# EAGLE design GB Cart Extender (EAGLE 9.0.1)
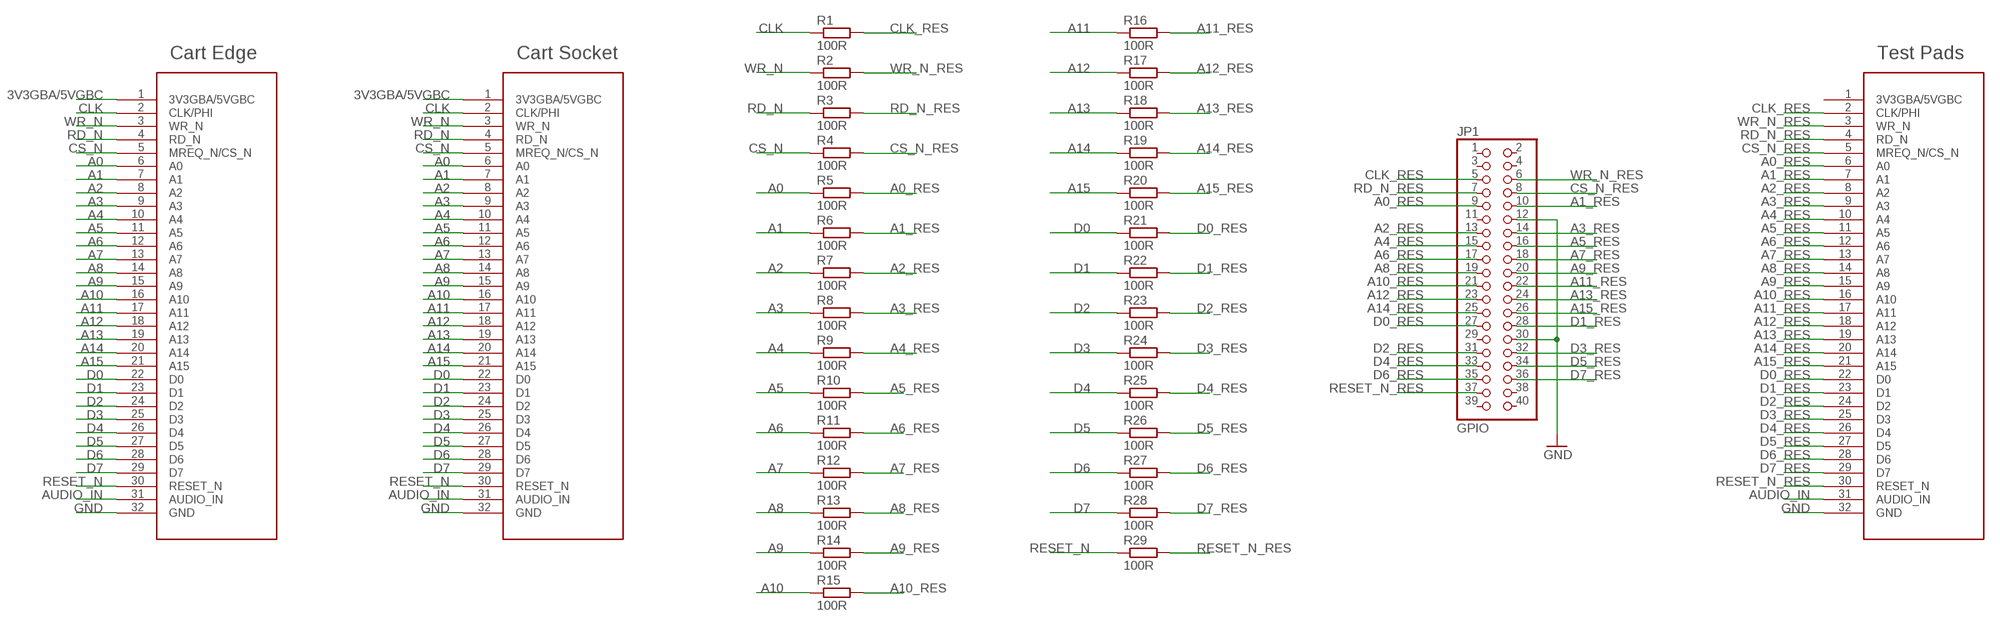
[diagram p0: schematic, sheet 1]

## Parts
EDGE  GB_CART_EDGE  [GB_CART_EDGE]
JP1  GPIO  PINHD-2X20SMT  [2X20_SMT]
PADS  GB_CART_SOCKET  [GB_CART_1]
R1  100R  R-EU_R0603  [R0603]
R2  100R  R-EU_R0603  [R0603]
R3  100R  R-EU_R0603  [R0603]
R4  100R  R-EU_R0603  [R0603]
R5  100R  R-EU_R0603  [R0603]
R6  100R  R-EU_R0603  [R0603]
R7  100R  R-EU_R0603  [R0603]
R8  100R  R-EU_R0603  [R0603]
R9  100R  R-EU_R0603  [R0603]
R10  100R  R-EU_R0603  [R0603]
R11  100R  R-EU_R0603  [R0603]
R12  100R  R-EU_R0603  [R0603]
R13  100R  R-EU_R0603  [R0603]
R14  100R  R-EU_R0603  [R0603]
R15  100R  R-EU_R0603  [R0603]
R16  100R  R-EU_R0603  [R0603]
R17  100R  R-EU_R0603  [R0603]
R18  100R  R-EU_R0603  [R0603]
R19  100R  R-EU_R0603  [R0603]
R20  100R  R-EU_R0603  [R0603]
R21  100R  R-EU_R0603  [R0603]
R22  100R  R-EU_R0603  [R0603]
R23  100R  R-EU_R0603  [R0603]
R24  100R  R-EU_R0603  [R0603]
R25  100R  R-EU_R0603  [R0603]
R26  100R  R-EU_R0603  [R0603]
R27  100R  R-EU_R0603  [R0603]
R28  100R  R-EU_R0603  [R0603]
R29  100R  R-EU_R0603  [R0603]
SOCKET  GB_CART_SOCKET  [GB_CART_1]

## Nets
3V3GBA/5VGBC: EDGE.1(3V3GBA/5VGBC) SOCKET.1(3V3GBA/5VGBC)
A0: EDGE.6(A0) R5.1 SOCKET.6(A0)
A0_RES: JP1.9 PADS.6(A0) R5.2
A1: EDGE.7(A1) R6.1 SOCKET.7(A1)
A1_RES: JP1.10 PADS.7(A1) R6.2
A2: EDGE.8(A2) R7.1 SOCKET.8(A2)
A2_RES: JP1.13 PADS.8(A2) R7.2
A3: EDGE.9(A3) R8.1 SOCKET.9(A3)
A3_RES: JP1.14 PADS.9(A3) R8.2
A4: EDGE.10(A4) R9.1 SOCKET.10(A4)
A4_RES: JP1.15 PADS.10(A4) R9.2
A5: EDGE.11(A5) R10.1 SOCKET.11(A5)
A5_RES: JP1.16 PADS.11(A5) R10.2
A6: EDGE.12(A6) R11.1 SOCKET.12(A6)
A6_RES: JP1.17 PADS.12(A6) R11.2
A7: EDGE.13(A7) R12.1 SOCKET.13(A7)
A7_RES: JP1.18 PADS.13(A7) R12.2
A8: EDGE.14(A8) R13.1 SOCKET.14(A8)
A8_RES: JP1.19 PADS.14(A8) R13.2
A9: EDGE.15(A9) R14.1 SOCKET.15(A9)
A9_RES: JP1.20 PADS.15(A9) R14.2
A10: EDGE.16(A10) R15.1 SOCKET.16(A10)
A10_RES: JP1.21 PADS.16(A10) R15.2
A11: EDGE.17(A11) R16.1 SOCKET.17(A11)
A11_RES: JP1.22 PADS.17(A11) R16.2
A12: EDGE.18(A12) R17.1 SOCKET.18(A12)
A12_RES: JP1.23 PADS.18(A12) R17.2
A13: EDGE.19(A13) R18.1 SOCKET.19(A13)
A13_RES: JP1.24 PADS.19(A13) R18.2
A14: EDGE.20(A14) R19.1 SOCKET.20(A14)
A14_RES: JP1.25 PADS.20(A14) R19.2
A15: EDGE.21(A15) R20.1 SOCKET.21(A15)
A15_RES: JP1.26 PADS.21(A15) R20.2
AUDIO_IN: EDGE.31(AUDIO_IN) PADS.31(AUDIO_IN) SOCKET.31(AUDIO_IN)
CLK: EDGE.2(CLK/PHI) R1.1 SOCKET.2(CLK/PHI)
CLK_RES: JP1.5 PADS.2(CLK/PHI) R1.2
CS_N: EDGE.5(MREQ_N/CS_N) R4.1 SOCKET.5(MREQ_N/CS_N)
CS_N_RES: JP1.8 PADS.5(MREQ_N/CS_N) R4.2
D0: EDGE.22(D0) R21.1 SOCKET.22(D0)
D0_RES: JP1.27 PADS.22(D0) R21.2
D1: EDGE.23(D1) R22.1 SOCKET.23(D1)
D1_RES: JP1.28 PADS.23(D1) R22.2
D2: EDGE.24(D2) R23.1 SOCKET.24(D2)
D2_RES: JP1.31 PADS.24(D2) R23.2
D3: EDGE.25(D3) R24.1 SOCKET.25(D3)
D3_RES: JP1.32 PADS.25(D3) R24.2
D4: EDGE.26(D4) R25.1 SOCKET.26(D4)
D4_RES: JP1.33 PADS.26(D4) R25.2
D5: EDGE.27(D5) R26.1 SOCKET.27(D5)
D5_RES: JP1.34 PADS.27(D5) R26.2
D6: EDGE.28(D6) R27.1 SOCKET.28(D6)
D6_RES: JP1.35 PADS.28(D6) R27.2
D7: EDGE.29(D7) R28.1 SOCKET.29(D7)
D7_RES: JP1.36 PADS.29(D7) R28.2
GND: EDGE.32(GND) JP1.12 JP1.30 PADS.32(GND) SOCKET.32(GND)
RD_N: EDGE.4(RD_N) R3.1 SOCKET.4(RD_N)
RD_N_RES: JP1.7 PADS.4(RD_N) R3.2
RESET_N: EDGE.30(RESET_N) R29.1 SOCKET.30(RESET_N)
RESET_N_RES: JP1.37 PADS.30(RESET_N) R29.2
WR_N: EDGE.3(WR_N) R2.1 SOCKET.3(WR_N)
WR_N_RES: JP1.6 PADS.3(WR_N) R2.2
Unconnected: JP1.1 JP1.2 JP1.3 JP1.4 JP1.11 JP1.29 JP1.38 JP1.39 JP1.40 PADS.1(3V3GBA/5VGBC)

## Notes on the sheet
- Cart Edge | Cart Socket | Test Pads

## Library data of the parts
EDGE = alex:GB_CART_EDGE
JP1 = pinhead+:PINHD-2X20: PIN HEADER; SPICEPREFIX: X
PADS = alex:GB_CART_SOCKET; SPICEPREFIX: X
R1-R29 = rcl:R-EU_: RESISTOR, European symbol; SPICEPREFIX: R
SOCKET = alex:GB_CART_SOCKET

## Board
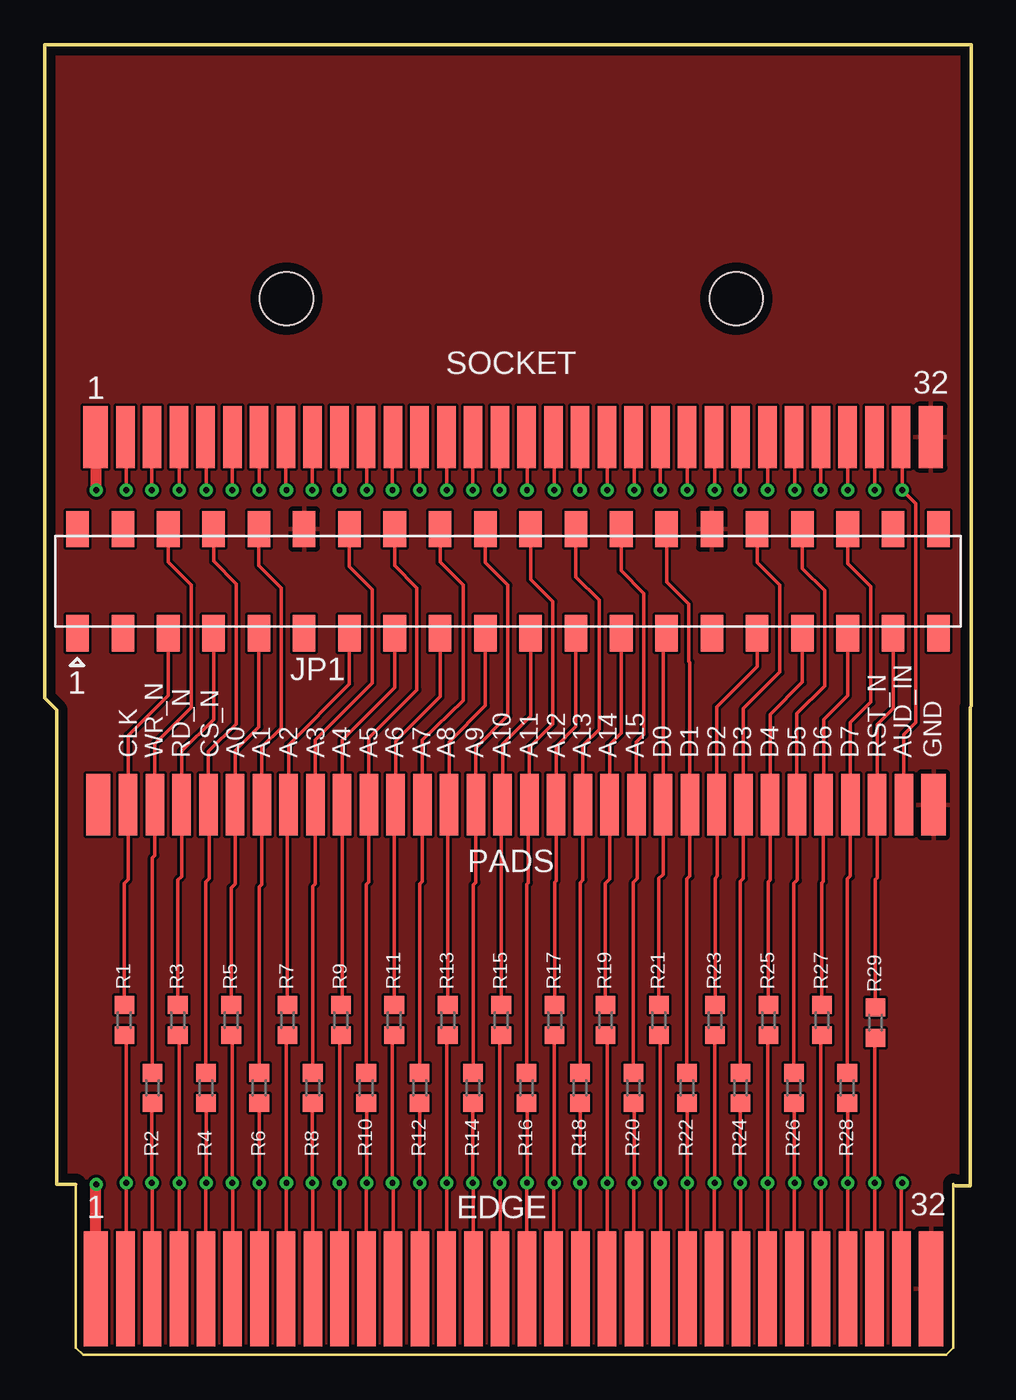
[diagram p1: board, top side]
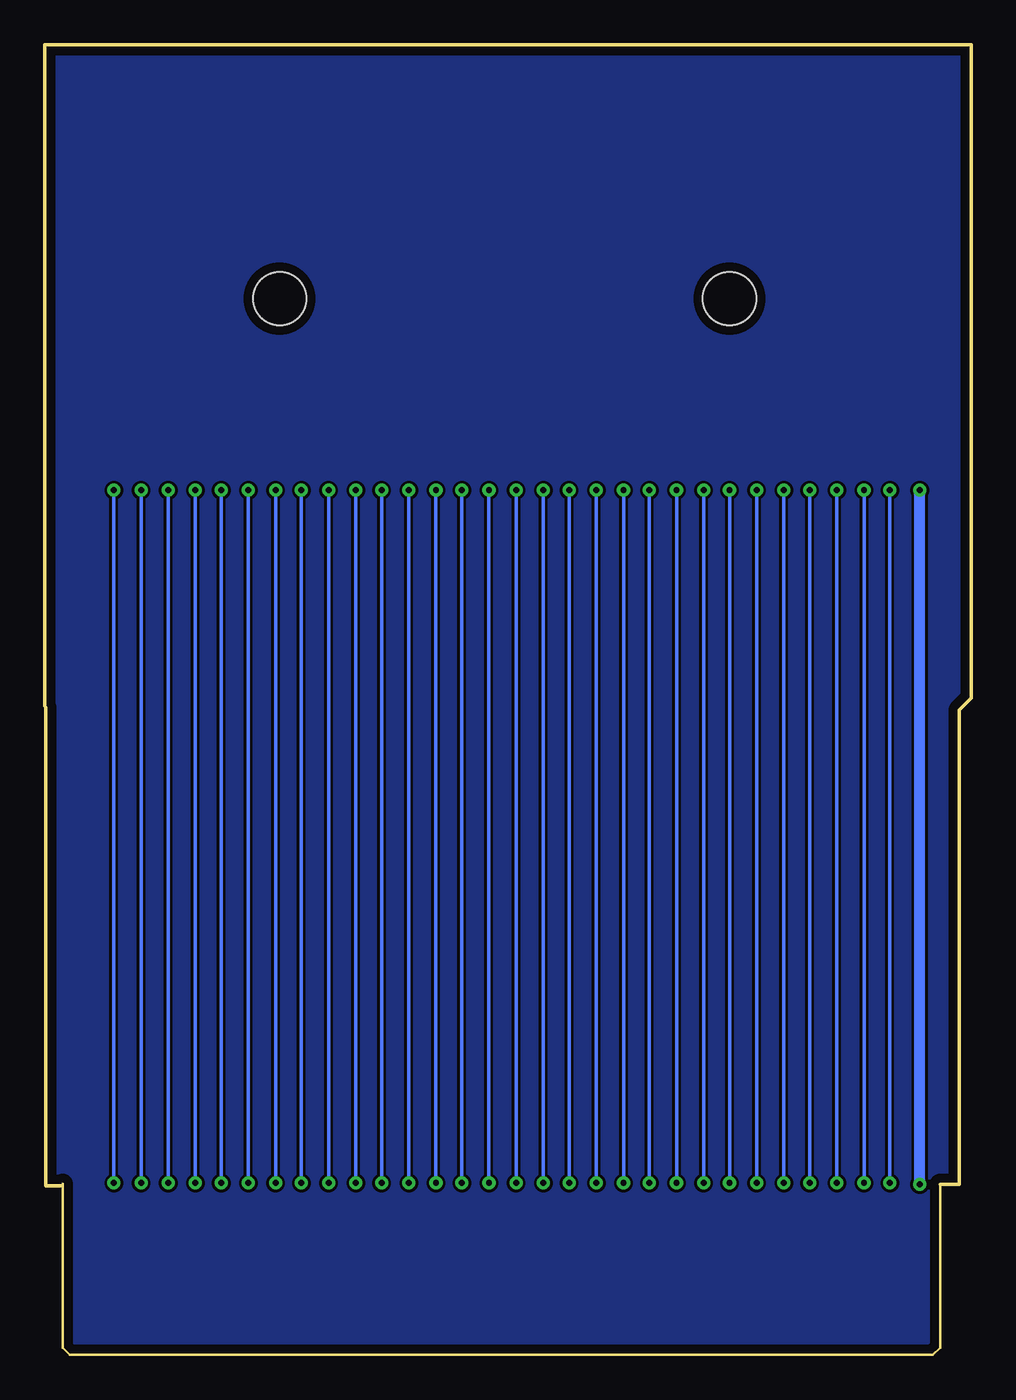
[diagram p2: board, bottom side, seen from below]

Size 51.97 x 73.5 mm. Coordinates in mm from the lower left corner, seen from the top.
Outline: 50.98,9.49 51.89,9.49 51.89,36.31 51.97,36.39 51.97,73.5 0,73.5 0,36.85 0.69,36.16 0.69,9.57 1.75,9.57
Copper layers (1*16): Top 0.035mm / dielectric 1.5mm / Bottom 0.035mm
Design rules "default *": minimum track width 5mil, minimum drill 13mil, track to track 6mil, track to pad 6mil, pad to pad 6mil, via to via 6mil, smd to smd 6mil, copper to edge 20mil, drill to drill 8mil, minimum pad ring 10mil, minimum via ring 8mil, stop-mask expansion 4mil, vias tented up to drill 0mil, thermal gap 10mil
Holes 3 mm at 13.56,59.25 38.79,59.25

### Footprints (pad centres in the part's own frame; a part is rotated, then mirrored left to right if it is on the bottom)
GB_CART_EDGE = smd 1.36 x 6.46: 1 -22.885,0.11; 32 23.95,0.11 | smd 1.03 x 6.46: 2 -21.215,0.11; 3 -19.715,0.11; 4 -18.215,0.11; 5 -16.715,0.11; 6 -15.215,0.11; 7 -13.715,0.11; 8 -12.215,0.11; 9 -10.715,0.11; 10 -9.215,0.11; 11 -7.715,0.11; 12 -6.215,0.11; 13 -4.715,0.11; 14 -3.215,0.11; 15 -1.715,0.11; 16 -0.215,0.11; 17 1.285,0.11; 18 2.785,0.11; 19 4.285,0.11; 20 5.785,0.11; 21 7.285,0.11; 22 8.785,0.11; 23 10.285,0.11; 24 11.785,0.11; 25 13.285,0.11; 26 14.785,0.11; 27 16.285,0.11; 28 17.785,0.11; 29 19.285,0.11; 30 20.785,0.11; 31 22.285,0.11
2X20_SMT = smd 1.27 x 2.032: 1 -24.13,-2.921; 2 -24.13,2.921; 3 -21.59,-2.921; 4 -21.59,2.921; 5 -19.05,-2.921; 6 -19.05,2.921; 7 -16.51,-2.921; 8 -16.51,2.921; 9 -13.97,-2.921; 10 -13.97,2.921; 11 -11.43,-2.921; 12 -11.43,2.921; 13 -8.89,-2.921; 14 -8.89,2.921; 15 -6.35,-2.921; 16 -6.35,2.921; 17 -3.81,-2.921; 18 -3.81,2.921; 19 -1.27,-2.921; 20 -1.27,2.921; 21 1.27,-2.921; 22 1.27,2.921; 23 3.81,-2.921; 24 3.81,2.921; 25 6.35,-2.921; 26 6.35,2.921; 27 8.89,-2.921; 28 8.89,2.921; 29 11.43,-2.921; 30 11.43,2.921; 31 13.97,-2.921; 32 13.97,2.921; 33 16.51,-2.921; 34 16.51,2.921; 35 19.05,-2.921; 36 19.05,2.921; 37 21.59,-2.921; 38 21.59,2.921; 39 24.13,-2.921; 40 24.13,2.921
GB_CART_1 = smd 1.36 x 3.46: 1 -22.895,-0.12; 32 23.94,-0.12 | smd 1.03 x 3.46: 2 -21.225,-0.12; 3 -19.725,-0.12; 4 -18.225,-0.12; 5 -16.725,-0.12; 6 -15.225,-0.12; 7 -13.725,-0.12; 8 -12.225,-0.12; 9 -10.725,-0.12; 10 -9.225,-0.12; 11 -7.725,-0.12; 12 -6.225,-0.12; 13 -4.725,-0.12; 14 -3.225,-0.12; 15 -1.725,-0.12; 16 -0.225,-0.12; 17 1.275,-0.12; 18 2.775,-0.12; 19 4.275,-0.12; 20 5.775,-0.12; 21 7.275,-0.12; 22 8.775,-0.12; 23 10.275,-0.12; 24 11.775,-0.12; 25 13.275,-0.12; 26 14.775,-0.12; 27 16.275,-0.12; 28 17.775,-0.12; 29 19.275,-0.12; 30 20.775,-0.12; 31 22.275,-0.12
R0603 = smd 1 x 1.1: 1 -0.85,0; 2 0.85,0

### Placement (x,y rotation side)
EDGE  25.76,3.6 0 top
JP1  25.98,43.4 0 top
PADS  25.91,30.98 0 top
R1  4.47,18.79 90 top
R2  6.05,14.98 90 top
R3  7.47,18.79 90 top
R4  9.04,14.98 90 top
R5  10.46,18.79 90 top
R6  12.04,14.98 90 top
R7  13.61,18.79 90 top
R8  15.04,14.98 90 top
R9  16.61,18.79 90 top
R10  18.03,14.98 90 top
R11  19.61,18.79 90 top
R12  21.03,14.98 90 top
R13  22.61,18.79 90 top
R14  24.03,14.98 90 top
R15  25.6,18.79 90 top
R16  27.03,14.98 90 top
R17  28.6,18.79 90 top
R18  30.02,14.98 90 top
R19  31.45,18.79 90 top
R20  33.02,14.98 90 top
R21  34.44,18.79 90 top
R22  36.02,14.98 90 top
R23  37.59,18.79 90 top
R24  39.01,14.98 90 top
R25  40.59,18.79 90 top
R26  42.01,14.98 90 top
R27  43.59,18.79 90 top
R28  45.01,14.98 90 top
R29  46.58,18.64 90 top
SOCKET  25.76,51.61 0 top

### Tracks (layer width: path | path; a pad name or v marks a point on that pad's centre or on a via)
3V3GBA/5VGBC  (via drill 0.33)
  Top 0.203: 2.87,9.54 v2.9,9.57 | 2.9,51.45 SOCKET.1
  Top 0.61: EDGE.1 2.87,9.54 | v2.9,48.51 2.9,51.45
  Bottom 0.61: v2.9,9.57 v2.9,48.51
A0  (via drill 0.33)
  Top 0.203: 10.54,17.86 10.52,17.89 | EDGE.6 10.54,9.62 v10.52,9.64 10.52,17.89 | v10.52,48.51 10.52,51.47 SOCKET.6 | 10.52,17.89 R5.1
  Bottom 0.203: v10.52,9.64 v10.52,48.51
A0_RES
  Top 0.203: R5.2 10.46,26.21 10.68,26.42 PADS.6 10.68,33.89 12.01,35.22 JP1.9
A1  (via drill 0.33)
  Top 0.203: EDGE.7 v12.04,9.64 | v12.04,9.64 | v12.04,48.51 v12.03,48.52 SOCKET.7 | v12.04,9.64 R6.1
  Bottom 0.203: v12.04,9.64 v12.04,48.51
A1_RES
  Top 0.203: JP1.10 12.01,44.27 13.26,43.02 13.26,35.17 12.18,34.1 PADS.7 12.18,26.4 12.04,26.26 R6.2
A2  (via drill 0.33)
  Top 0.203: EDGE.8 13.54,9.62 v13.56,9.64 13.56,17.89 R7.1 | v13.56,48.51 13.53,48.54 SOCKET.8
  Bottom 0.203: v13.56,9.64 v13.56,48.51
A2_RES
  Top 0.203: R7.2 13.61,30.79 PADS.8 13.68,34.22 17.09,37.64 JP1.13
A3  (via drill 0.33)
  Top 0.203: R8.1 15.01,14.1 v15.01,9.64 15.04,9.62 EDGE.9 | v15.01,48.51 15.01,51.47 SOCKET.9
  Bottom 0.203: v15.01,9.64 v15.01,48.51
A3_RES
  Top 0.203: JP1.14 17.09,44.22 18.36,42.95 18.36,37.69 15.18,34.51 PADS.9 15.18,26.43 15.04,26.28 R8.2
A4  (via drill 0.33)
  Top 0.203: EDGE.10 v16.54,9.64 | v16.54,9.64 | v16.54,48.51 SOCKET.10 | v16.54,9.64 16.54,17.87 R9.1
  Bottom 0.203: v16.54,9.64 v16.54,48.51
A4_RES
  Top 0.203: R9.2 16.68,19.71 PADS.10 16.68,34.48 19.63,37.43 JP1.15
A5  (via drill 0.33)
  Top 0.203: EDGE.11 18.04,9.63 v18.06,9.64 18.06,14.1 R10.1 | v18.06,48.51 18.06,51.46 SOCKET.11
  Bottom 0.203: v18.06,9.64 v18.06,48.51
A5_RES
  Top 0.203: JP1.16 19.63,44.27 20.88,43.02 20.88,37.31 18.18,34.61 PADS.11 18.18,26.53 18.03,26.38 R10.2
A6  (via drill 0.33)
  Top 0.203: EDGE.12 19.54,9.61 v19.51,9.64 19.51,17.84 R11.1 | v19.51,48.51 19.51,51.46 SOCKET.12
  Bottom 0.203: v19.51,9.64 v19.51,48.51
A6_RES
  Top 0.203: R11.2 19.61,30.79 PADS.12 19.68,34.43 22.17,36.92 JP1.17
A7  (via drill 0.33)
  Top 0.203: R12.1 21.03,14.11 v21.03,9.64 21.04,9.64 EDGE.13 | v21.03,48.51 SOCKET.13
  Bottom 0.203: v21.03,9.64 v21.03,48.51
A7_RES
  Top 0.203: JP1.18 22.17,44.47 23.47,43.17 23.47,36.7 21.18,34.49 PADS.13 21.18,26.56 21.03,26.41 R12.2
A8  (via drill 0.33)
  Top 0.203: 22.54,17.87 R13.1 22.56,17.89 v22.56,9.64 22.54,9.63 EDGE.14 | v22.56,48.51 22.56,51.46 SOCKET.14
  Bottom 0.203: v22.56,9.64 v22.56,48.51
A8_RES
  Top 0.203: R13.2 22.61,30.78 PADS.14 22.68,34.39 24.71,36.42 JP1.19
A9  (via drill 0.33)
  Top 0.203: 24.04,14.12 R14.1 24,14.1 v24,9.64 24.04,9.61 EDGE.15 | v24,48.51 24,51.46 SOCKET.15
  Bottom 0.203: v24,9.64 v24,48.51
A9_RES
  Top 0.203: JP1.20 24.71,44.44 25.98,43.17 25.98,35.86 24.18,34.06 PADS.15 24.18,26.51 24.03,26.36 R14.2
A10  (via drill 0.33)
  Top 0.203: 25.54,17.88 R15.1 25.53,17.86 v25.53,9.64 25.54,9.63 EDGE.16 | v25.53,48.51 SOCKET.16
  Bottom 0.203: v25.53,9.64 v25.53,48.51
A10_RES
  Top 0.203: R15.2 25.6,30.78 PADS.16 25.68,34.26 27.25,35.83 JP1.21
A11  (via drill 0.33)
  Top 0.203: EDGE.17 27.04,9.63 v27.05,9.64 27.05,14.1 R16.1 | v27.05,48.51 27.05,51.47 SOCKET.17
  Bottom 0.203: v27.05,9.64 v27.05,48.51
A11_RES
  Top 0.203: JP1.22 27.25,43.5 28.5,42.26 28.5,35.4 27.18,34.09 PADS.17 27.13,30.8 27.13,26.48 27.03,26.38 R16.2
A12  (via drill 0.33)
  Top 0.203: 28.54,17.88 28.56,17.89 | 28.56,17.89 R17.1 | EDGE.18 28.54,9.61 v28.57,9.64 28.57,17.88 28.56,17.89 | v28.57,48.51 28.57,51.44 SOCKET.18
  Bottom 0.203: v28.57,9.64 v28.57,48.51
A12_RES
  Top 0.203: R17.2 28.6,26.51 28.68,26.59 PADS.18 28.68,34.14 29.79,35.25 JP1.23
A13  (via drill 0.33)
  Top 0.203: R18.1 30.04,14.11 30.02,14.09 v30.02,9.64 30.04,9.63 EDGE.19 | v30.02,48.51 v30.03,48.52 SOCKET.19
  Bottom 0.203: v30.02,9.64 v30.02,48.51
A13_RES
  Top 0.203: R18.2 30.02,26.48 30.18,26.65 PADS.19 30.18,34.19 31.09,35.1 31.09,42.34 29.79,43.63 JP1.24
A14  (via drill 0.33)
  Top 0.203: R19.1 31.54,17.84 31.54,9.64 | EDGE.20 31.54,9.64 | 31.54,9.64 v31.55,9.64 | v31.55,48.51 31.55,51.47 SOCKET.20
  Bottom 0.203: v31.55,9.64 v31.55,48.51
A14_RES
  Top 0.203: R19.2 31.45,26.46 31.68,26.7 PADS.20 31.68,34.24 32.33,34.89 JP1.25
A15  (via drill 0.33)
  Top 0.203: 33.04,14.11 R20.1 33.07,14.08 v33.07,9.64 33.04,9.62 EDGE.21 | v33.07,48.51 33.07,51.45 SOCKET.21
  Bottom 0.203: v33.07,9.64 v33.07,48.51
A15_RES
  Top 0.203: R20.2 33.02,26.51 33.22,26.71 33.22,30.82 PADS.21 33.18,34.37 33.6,34.79 33.6,42.72 32.33,43.99 JP1.26
AUDIO_IN  (via drill 0.33)
  Top 0.203: EDGE.31 48.04,9.6 v48.08,9.64 | SOCKET.31 48.08,51.43 v48.08,48.51 48.84,47.74 48.84,35.48 48.18,34.82 PADS.31
  Bottom 0.203: v48.08,9.64 v48.08,48.51
CLK  (via drill 0.33)
  Top 0.203: 4.54,17.87 R1.1 4.57,17.84 v4.57,9.64 4.57,3.74 EDGE.2 | v4.57,48.51 4.57,51.45 SOCKET.2
  Bottom 0.203: v4.57,9.64 v4.57,48.51
CLK_RES
  Top 0.203: R1.2 4.47,26.46 4.68,26.67 PADS.2 4.68,34.75 6.93,37 JP1.5
CS_N  (via drill 0.33)
  Top 0.203: R4.1 9.07,14.1 v9.07,9.64 9.04,9.62 EDGE.5 | v9.07,48.51 9.07,51.45 SOCKET.5
  Bottom 0.203: v9.07,9.64 v9.07,48.51
CS_N_RES
  Top 0.203: JP1.8 9.47,44.52 10.74,43.25 10.74,35.4 9.18,33.84 PADS.5 9.22,30.82 9.22,26.71 9.04,26.54 R4.2
D0  (via drill 0.33)
  Top 0.203: R21.1 34.54,17.84 34.52,17.82 v34.52,9.64 34.54,9.62 EDGE.22 | v34.52,48.51 34.53,48.52 SOCKET.22
  Bottom 0.203: v34.52,9.64 v34.52,48.51
D0_RES
  Top 0.203: JP1.27 34.9,40.45 34.68,40.24 PADS.22 34.68,26.95 34.44,26.71 R21.2
D1  (via drill 0.33)
  Top 0.203: R22.1 36.04,14.11 v36.04,9.64 | EDGE.23 v36.04,9.64 | v36.04,9.64 | v36.04,48.51 36.04,51.47 SOCKET.23
  Bottom 0.203: v36.04,9.64 v36.04,48.51
D1_RES
  Top 0.203: JP1.28 34.87,43.35 36.12,42.11 36.12,38.91 36.18,38.84 PADS.23 36.18,26.85 36.02,26.69 R22.2
D2  (via drill 0.33)
  Top 0.203: 37.54,17.89 R23.1 37.57,17.91 v37.57,9.64 37.54,9.62 EDGE.24 | v37.57,48.51 37.57,51.45 SOCKET.24
  Bottom 0.203: v37.57,9.64 v37.57,48.51
D2_RES
  Top 0.203: R23.2 37.59,26.74 37.72,26.87 37.72,30.82 PADS.24 37.68,36.36 39.95,38.63 JP1.31
D3  (via drill 0.33)
  Top 0.203: R24.1 39.04,14.1 39.01,14.08 v39.01,9.64 39.04,9.62 EDGE.25 | v39.01,48.51 39.01,51.47 SOCKET.25
  Bottom 0.203: v39.01,9.64 v39.01,48.51
D3_RES
  Top 0.203: JP1.32 39.95,44.44 41.22,43.17 41.22,38.3 39.18,36.25 PADS.25 39.18,26.73 39.01,26.56 R24.2
D4  (via drill 0.33)
  Top 0.203: R25.1 40.54,17.89 v40.54,9.64 | EDGE.26 v40.54,9.64 | v40.54,9.64 | v40.54,48.51 40.54,51.48 SOCKET.26
  Bottom 0.203: v40.54,9.64 v40.54,48.51
D4_RES
  Top 0.203: R25.2 40.59,26.54 40.69,26.64 PADS.26 | PADS.26 | PADS.26 40.69,35.93 42.49,37.74 JP1.33
D5  (via drill 0.33)
  Top 0.203: EDGE.27 42.04,9.62 | 42.04,9.62 v42.06,9.64 | v42.06,48.51 42.06,51.45 SOCKET.27 | 42.04,9.62 42.04,14.1 R26.1
  Bottom 0.203: v42.06,9.64 v42.06,48.51
D5_RES
  Top 0.203: JP1.34 42.49,44.11 43.74,42.87 43.74,37.53 42.18,35.98 PADS.27 42.21,30.83 42.21,26.64 42.01,26.44 R26.2
D6  (via drill 0.33)
  Top 0.203: EDGE.28 43.54,9.62 v43.51,9.64 43.51,17.86 R27.1 | v43.51,48.51 43.51,51.47 SOCKET.28
  Bottom 0.203: v43.51,9.64 v43.51,48.51
D6_RES
  Top 0.203: R27.2 43.59,26.48 43.66,26.56 43.66,30.84 PADS.28 43.68,35.65 45.03,37 JP1.35
D7  (via drill 0.33)
  Top 0.203: 45.04,14.1 R28.1 45.03,14.1 v45.03,9.64 45.04,9.64 EDGE.29 | v45.03,48.51 SOCKET.29
  Bottom 0.203: v45.03,9.64 v45.03,48.51
D7_RES
  Top 0.203: JP1.36 45.03,44.39 46.33,43.1 46.33,36.62 45.18,35.47 PADS.29 45.18,26.86 45.01,26.69 R28.2
GND
  pour Top: 0,73.42 51.97,73.5 51.97,36.39 51.89,36.32 51.89,9.49 50.98,9.49 50.98,0.42 50.52,-0.03 2.21,-0.03 1.75,0.42 1.75,9.57 0.69,9.57 0.69,36.16 0,36.85
  pour Bottom: 0,73.42 51.97,73.5 51.97,36.39 51.89,36.32 51.89,9.49 50.98,9.49 50.98,0.42 50.52,-0.03 2.21,-0.03 1.75,0.42 1.75,9.57 0.69,9.57 0.69,36.16 0,36.85
RD_N  (via drill 0.33)
  Top 0.203: R3.1 7.54,17.87 v7.54,9.64 | EDGE.4 v7.54,9.64 | v7.54,9.64 | v7.54,48.51 7.54,51.47 SOCKET.4
  Bottom 0.203: v7.54,9.64 v7.54,48.51
RD_N_RES
  Top 0.203: R3.2 7.47,26.64 7.68,26.85 PADS.4 7.68,33.86 9.47,35.66 JP1.7
RESET_N  (via drill 0.33)
  Top 0.203: 46.54,17.74 R29.1 46.56,17.76 v46.56,9.64 46.54,9.63 EDGE.30 | v46.56,48.51 46.56,51.46 SOCKET.30
  Bottom 0.203: v46.56,9.64 v46.56,48.51
RESET_N_RES
  Top 0.203: R29.2 46.58,26.66 46.68,26.76 PADS.30 46.68,35.37 47.57,36.26 JP1.37
WR_N  (via drill 0.33)
  Top 0.203: EDGE.3 6.04,9.62 v6.02,9.64 6.02,14.1 R2.1 | v6.02,48.51 6.02,51.48 SOCKET.3
  Bottom 0.203: v6.02,9.64 v6.02,48.51
WR_N_RES
  Top 0.203: JP1.6 6.93,44.47 8.23,43.17 8.23,36.31 6.18,34.27 PADS.3 6.18,28.02 6.05,27.88 R2.2

### Text on the board
tPlace: 32 | 1 | 1 | CLK | WR_N | RD_N | CS_N | A0 | A1 | A2 | A3 | A4 | A5 | A6 | A7 | A8 | A9 | A10 | A11 | A12 | A13 | A14 | A15 | D0 | D1 | D2 | D3 | D4 | D5 | D6 | D7 | RST_N | AUD_IN | GND | 32 | 1